# Altium schematic sheet led chaser schematic.SchDoc
size A; SheetNumber: 1; SheetTotal: 1
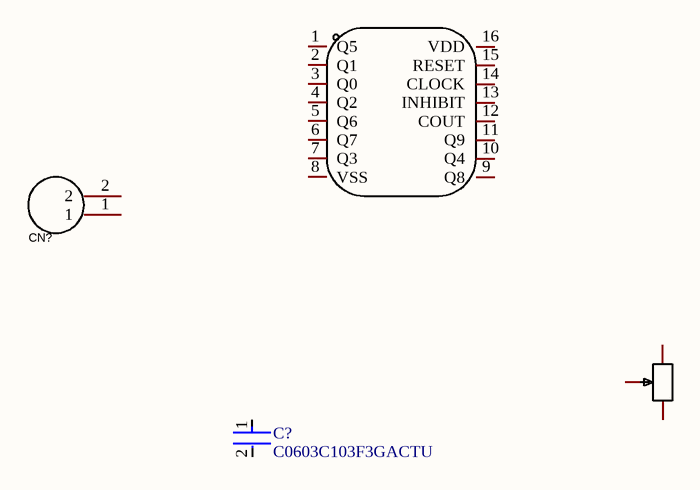
[diagram p0: led chaser schematic.SchDoc]

## Parts
C?  C0603C103F3GACTU  [FP-C0603C-CF-MFG]
CN?  WJ2EDGRC-5.08-2P  [CONN-TH_2P-P5.08_WJ2EDGRC-5.08-2P]  (value not drawn)
R?  3224W-1-100E  [RES-ADJ-SMD_3224W]  (value not drawn)
U?  CD4017BE  [DIP-16_L19.2-W6.6-P2.54-LS7.6-BL]  (value not drawn)

## Nets

Not connected (* = marked no-connect by the designer): C? 1 2; CN? 1 2; R? 1 2 3; U? 1(Q5) 2(Q1) 3(Q0) 4(Q2) 5(Q6) 6(Q7) 7(Q3) 8(VSS) 9(Q8) 10(Q4) 11(Q9) 12(COUT) 13(INHIBIT) 14(CLOCK) 15(RESET) 16(VDD)

## Library data of the parts
C? = CMP-2006-03370-2: CAP CER 10000PF 25V 1% NP0 0603; Manufacturer: KEMET; Automotive Grade: Grade 1; Description: C0603 10,000 pF C0G 30ppm/°C 1.00% 25 V; Capacitance: 10,000 pF; Temperature Coefficient: 30ppm/°C; Material: Ceramic; Value: 10,000 pF; Temperature Characteristic: C0G; Tolerance: 0.01; Temperature Range High: +125°C; Category: Cap; Mouser Description: Multilayer Ceramic Capacitors MLCC - SMD/SMT 25volts 10000pF 1% C0G; Automotive: Yes; Octopart: https://octopart.com/c0603c103f3gactu-kemet-12577573; ComponentLink2Description: Datasheet; Temperature Range Low: -55°C; Package: C0603C-CF; RoHS: TRUE; Temperature: -55°C to +125°C; Device Class L1: Passive Components; ComponentLink2URL: https://api.kemet.com/component-edge/download/datasheet/C0603C100J5GACAUTO.pdf; Voltage Rating: 25 V; Digikey Description: CAP CER 10000PF 25V 1% NP0 0603; Device Class L2: Capacitors; Device Class L3: Ceramic Capacitors; Manufacturer Part Number: C0603C103F3GACTU; Height: 0.87mm; Lead Free: Yes
CN? = WJ2EDGRC-5.08-2P: Manufacturer: KANGNEX(康奈克斯电气); Add into BOM: yes; Connector Type: 板端/Receptacle-Close; Structure: 1x2P; Pitch: 5.08mm; Number of PINs Per Row: 2; Symbol: WJ2EDGRC-5.08-2P; Device: WJ2EDGRC-5.08-2P; Supplier: LCSC; Manufacturer Part: WJ2EDGRC-5.08-2P; Supplier Part: C3697; JLCPCB Part Class: Extended Part; LCSC Part Name: 5.08mm 1x2P 排数:1 每排P数:2; Supplier Footprint: 弯插,P=5.08mm; Datasheet: https://atta.szlcsc.com/upload/public/pdf/source/20191225/C3697_6E7B45CD3FD3DA2CDF6A2CE707235E10.pdf; Convert to PCB: yes; Color: Green; Mounting Style: Bend; Number of Pins: 2P; Number of Rows: 1
R? = 3224W-1-100E: Manufacturer: BOURNS; Add into BOM: yes; Value: 10Ω; Tolerance: ±10%; Temperature Coefficient: ±100ppm/℃; Symbol: 3224W-1-100E; Device: 3224W-1-100E; LCSC Part Name: 10Ω ±10%; Supplier Part: C116317; Manufacturer Part: 3224W-1-100E; Supplier Footprint: SMD; JLCPCB Part Class: Extended Part; Datasheet: https://atta.szlcsc.com/upload/public/pdf/source/20170630/1498816666853.pdf; Supplier: LCSC; Convert to PCB: yes
U? = CD4017BE: Manufacturer: HGSEMI(华冠); Symbol: CD4017BE_C507168; Add into BOM: yes; Device: CD4017BE; LCSC Part Name: 具有 10 个解码输出的 CMOS 十进制计数器; Supplier Part: C507168; Manufacturer Part: CD4017BE; Supplier Footprint: DIP-16; JLCPCB Part Class: Extended Part; Datasheet: https://atta.szlcsc.com/upload/public/pdf/source/20200408/C507168_1EB3A770EB6186DF54EC929FA48E233F.pdf; Supplier: LCSC; Convert to PCB: yes